# EAGLE schematic schematic (EAGLE 9.1.3)
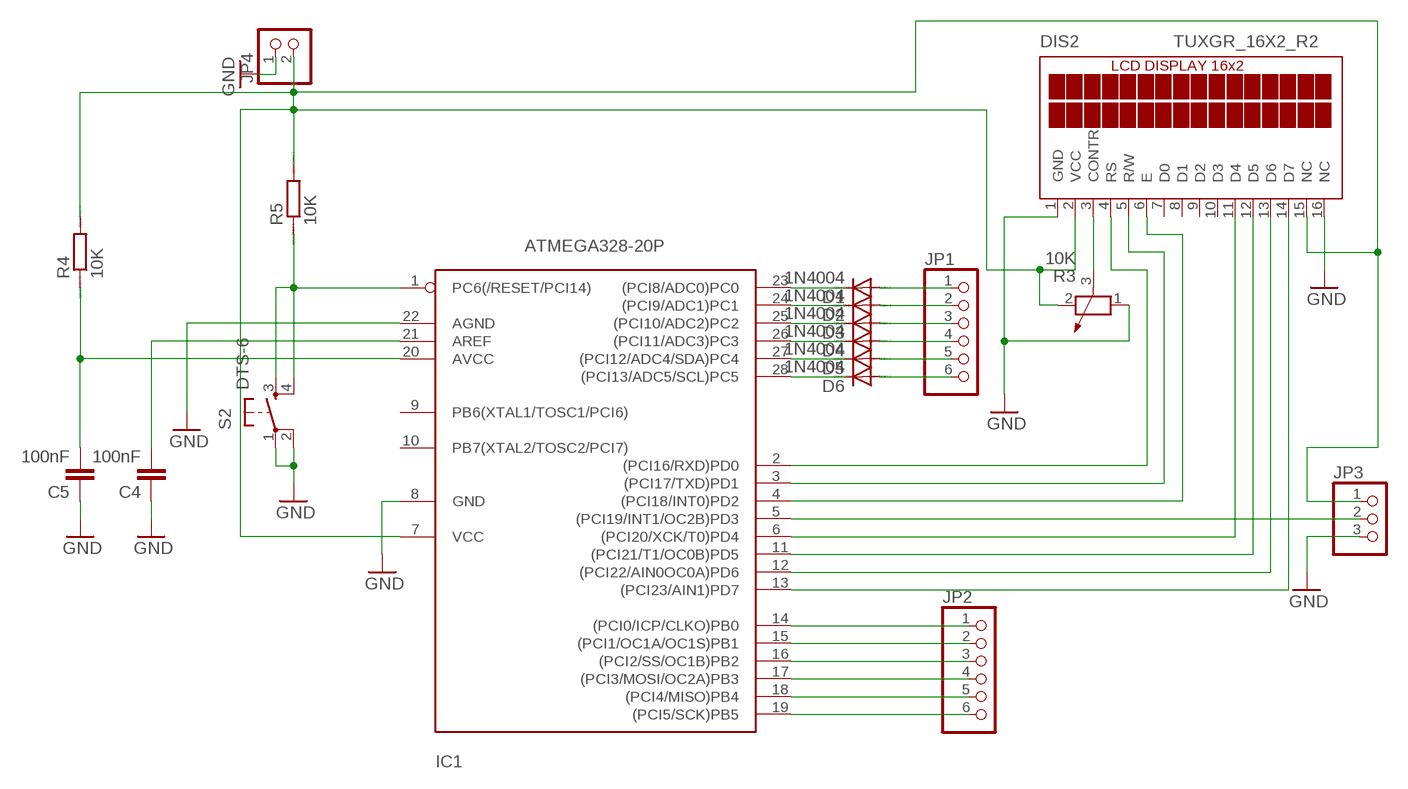
[diagram p0: schematic, sheet 1]

## Parts
C4  100nF  C-EU025-024X044  [C025-024X044]
C5  100nF  C-EU025-024X044  [C025-024X044]
D1  1N4004  [DO41-10]
D2  1N4004  [DO41-10]
D3  1N4004  [DO41-10]
D4  1N4004  [DO41-10]
D5  1N4004  [DO41-10]
D6  1N4004  [DO41-10]
DIS2  TUXGR_16X2_R2  [TUXGR_16X2_R2]
IC1  ATMEGA328-20P  [DIL28-3]
JP1  PINHD-1X6  [1X06]
JP2  PINHD-1X6  [1X06]
JP3  PINHD-1X3  [1X03]
JP4  PINHD-1X2  [1X02]
R3  10K  POTENTIOMETER_PT-10  [PT-10]
R4  10K  R0204/7  [0204/7]
R5  10K  R0204/7  [0204/7]
S2  DTS-6  [DTS-6]

## Nets
GND: C4.1 C5.1 DIS2.1(GND) IC1.8(GND) IC1.22(AGND) JP3.3 JP4.1 R3.1 S2.1 S2.2
N$1: D1.C IC1.23((PCI8/ADC0)PC0)
N$2: D2.C IC1.24((PCI9/ADC1)PC1)
N$3: DIS2.3(CONTR) R3.3
N$4: DIS2.6(E) IC1.4((PCI18/INT0)PD2)
N$5: C5.2 IC1.20(AVCC) R4.1
N$6: DIS2.5(R/W) IC1.3((PCI17/TXD)PD1)
N$7: IC1.5((PCI19/INT1/OC2B)PD3) JP3.2
N$8: DIS2.11(D4) IC1.6((PCI20/XCK/T0)PD4)
N$9: DIS2.12(D5) IC1.11((PCI21/T1/OC0B)PD5)
N$10: DIS2.13(D6) IC1.12((PCI22/AIN0OC0A)PD6)
N$11: DIS2.14(D7) IC1.13((PCI23/AIN1)PD7)
N$12: IC1.1(PC6(/RESET/PCI14)) R5.1 S2.3 S2.4
N$13: DIS2.4(RS) IC1.2((PCI16/RXD)PD0)
N$14: C4.2 IC1.21(AREF)
N$15: D3.C IC1.25((PCI10/ADC2)PC2)
N$16: D4.C IC1.26((PCI11/ADC3)PC3)
N$17: D5.C IC1.27((PCI12/ADC4/SDA)PC4)
N$18: D6.C IC1.28((PCI13/ADC5/SCL)PC5)
N$19: IC1.14((PCI0/ICP/CLKO)PB0) JP2.1
N$20: IC1.15((PCI1/OC1A/OC1S)PB1) JP2.2
N$21: IC1.16((PCI2/SS/OC1B)PB2) JP2.3
N$22: IC1.17((PCI3/MOSI/OC2A)PB3) JP2.4
N$23: IC1.18((PCI4/MISO)PB4) JP2.5
N$24: IC1.19((PCI5/SCK)PB5) JP2.6
N$25: DIS2.16(NC) ; supply symbol labelled GND
N$26: D1.A JP1.1
N$27: D2.A JP1.2
N$28: D3.A JP1.3
N$29: D4.A JP1.4
N$30: D5.A JP1.5
N$31: D6.A JP1.6
N$33: DIS2.2(VCC) DIS2.15(NC) IC1.7(VCC) JP3.1 JP4.2 R3.2 R4.2 R5.2
Unconnected: DIS2.7(D0) DIS2.8(D1) DIS2.9(D2) DIS2.10(D3) IC1.9(PB6(XTAL1/TOSC1/PCI6)) IC1.10(PB7(XTAL2/TOSC2/PCI7))

## Library data of the parts
C4 C5 = rcl:C-EU: CAPACITOR, European symbol; SPICEPREFIX: C
D1-D6 = diode:1N4004: DIODE general purpose rectifier, 1 A
DIS2 = display-lcd:TUXGR_16X2_R2: Tuxgraphics LCD display 16x2 characters reflective, without background light Source: tuxgr_12x2_r2.pdf; OC_FARNELL: unknown; OC_NEWARK: unknown
IC1 = atmega328:ATMEGA328*P: MICROCONTROLLER 32 kBytes FLASH 2 kBytes SRAM 1 kBytes EEPROM USART 8-channel 10 bit ADC
JP1 JP2 = pinhead:PINHD-1X6: PIN HEADER
JP3 = pinhead:PINHD-1X3: PIN HEADER
JP4 = pinhead:PINHD-1X2: PIN HEADER
R3 = rcl:POTENTIOMETER_: Potentiometer; SPICEMODEL: POT; SPICEPREFIX: X
R4 R5 = eagle-ltspice:R: RESISTOR, European symbol; SPICEMODEL: NONE; SPICEPREFIX: R
S2 = switch-tact:DTS-6

## Net classes
0 default: clearance 0.205 mm